# Altium schematic sheet USB.SchDoc
size 419 x 296 mm; SheetNumber: 2; SheetTotal: 5
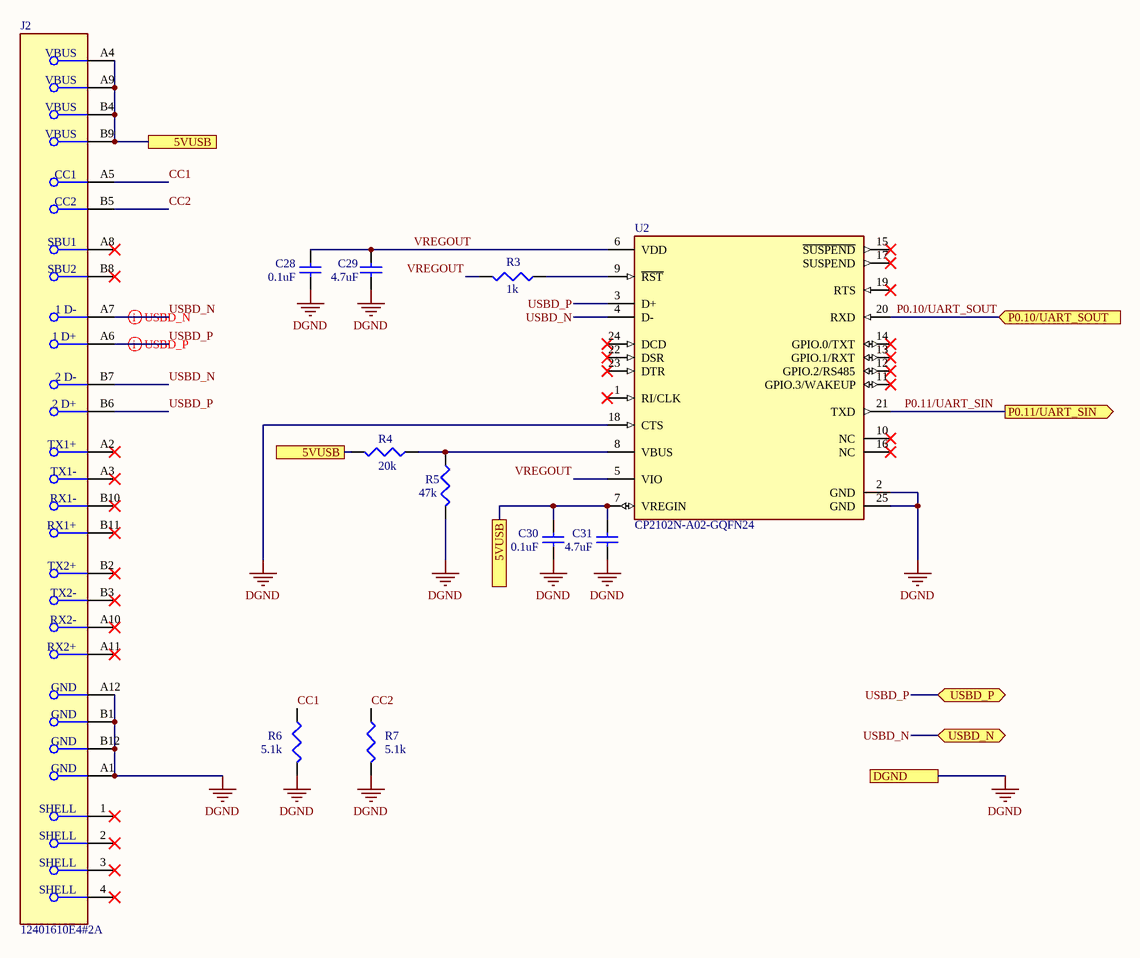
[diagram p0: USB.SchDoc]

## Parts
C28  value 0.1uF  [0402 SMD]  (hidden comment: C0402C104K4RAC7867)
C29  value 4.7uF  [0402 SMD]  (hidden comment: CL05A475KQ5NRNC)
C30  value 0.1uF  [0402 SMD]  (hidden comment: C0402C104K4RAC7867)
C31  value 4.7uF  [0402 SMD]  (hidden comment: CL05A475KQ5NRNC)
J2  12401610E4#2A  [FP-12401610E4#2A-MFG]
R3  value 1k  [0402 SMD]  (hidden comment: RC0402FR-071KL)
R4  value 20k  [0402 SMD]  (hidden comment: RC0402FR-0720KL)
R5  value 47k  [0402 SMD]  (hidden comment: RC0402FR-0747KL)
R6  value 5.1k  [0402 SMD]  (hidden comment: RC0402FR-075K1L)
R7  value 5.1k  [0402 SMD]  (hidden comment: RC0402FR-075K1L)
U2  CP2102N-A02-GQFN24  [FP-CP2102N-A02-GQFN24R-IPC_A]

## Ports
5VUSB, DGND, P0.10/UART_SOUT (in), P0.11/UART_SIN (out), USBD_N (bidir), USBD_P (bidir)

## Nets
DGND: C28.1 C29.1 C30.1 C31.1 J2.A1(GND) J2.A12(GND) J2.B1(GND) J2.B12(GND) R5.2 R6.2 R7.2 U2.2(GND) U2.18(CTS) U2.25(GND) ; port DGND
5VUSB: C30.2 C31.2 J2.A4(VBUS) J2.A9(VBUS) J2.B4(VBUS) J2.B9(VBUS) R4.2 U2.7(VREGIN) ; port 5VUSB
CC1: J2.A5(CC1) R6.1
CC2: J2.B5(CC2) R7.1
P0.10/UART_SOUT: U2.20(RXD) ; port P0.10/UART_SOUT
P0.11/UART_SIN: U2.21(TXD) ; port P0.11/UART_SIN
USBD_N: J2.A7(1_D-) J2.B7(2_D-) U2.4(D-) ; port USBD_N
USBD_P: J2.A6(1_D+) J2.B6(2_D+) U2.3(D+) ; port USBD_P
VREGOUT: C28.2 C29.2 R3.2 U2.5(VIO) U2.6(VDD)
NetR3_1: R3.1 U2.9(~{RST})
NetR4_1: R4.1 R5.1 U2.8(VBUS)

Not connected (* = marked no-connect by the designer): J2 1(SHELL)* 2(SHELL)* 3(SHELL)* 4(SHELL)* A2(TX1+)* A3(TX1-)* A8(SBU1)* A10(RX2-)* A11(RX2+)* B2(TX2+)* B3(TX2-)* B8(SBU2)* B10(RX1-)* B11(RX1+)*; U2 1(RI/CLK)* 10(NC)* 11(GPIO.3/WAKEUP)* 12(GPIO.2/RS485)* 13(GPIO.1/RXT)* 14(GPIO.0/TXT)* 15(~{SUSPEND})* 16(NC)* 17(SUSPEND)* 19(RTS)* 22(DSR)* 23(DTR)* 24(DCD)*

## Layout directives
differential pair: USBD_N, USBD_P

## Notes on the sheet
- Title
- Revision
- Project
- Approver
- Date
- Branch
- File

## Library data of the parts
C28 C30 = C0402C104K4RAC7867: 0.1 µF ±10% 16V Ceramic Capacitor X7R 0402 (1005 Metric) Kemet
C29 C31 = CL05A475KQ5NRNC: 4.7 µF ±10% 6.3V Ceramic Capacitor X5R 0402 (1005 Metric) Samsung
J2 = CMP-02355-000003-1: CONN RCP USB3.1 TYPEC 24P SMD RA; Connector Type: USB; Number of Contacts: 24; Gender: Receptacle; Packaging: Cut Tape; Mount: Surface Mount; Number of Pins: 24
R3 = RC0402FR-071KL: 1 kOhms ±1% 0.063W, 1/16W Chip Resistor 0402 (1005 Metric) Moisture Resistant Thick Film
R4 = RC0402FR-0720KL: 20 kOhms ±1% 0.063W, 1/16W Chip Resistor 0402 (1005 Metric) Moisture Resistant Thick Film
R5 = RC0402FR-0747KL: 47 kOhms ±1% 0.063W, 1/16W Chip Resistor 0402 (1005 Metric) Moisture Resistant Thick Film
R6 R7 = RC0402FR-075K1L: 5.1 kOhms ±1% 0.063W, 1/16W Chip Resistor 0402 (1005 Metric) Moisture Resistant Thick Film
U2 = CP2102N: IC USB TO UART BRIDGE QFN24